# EAGLE design EMUZ80R3 (EAGLE 4.16)
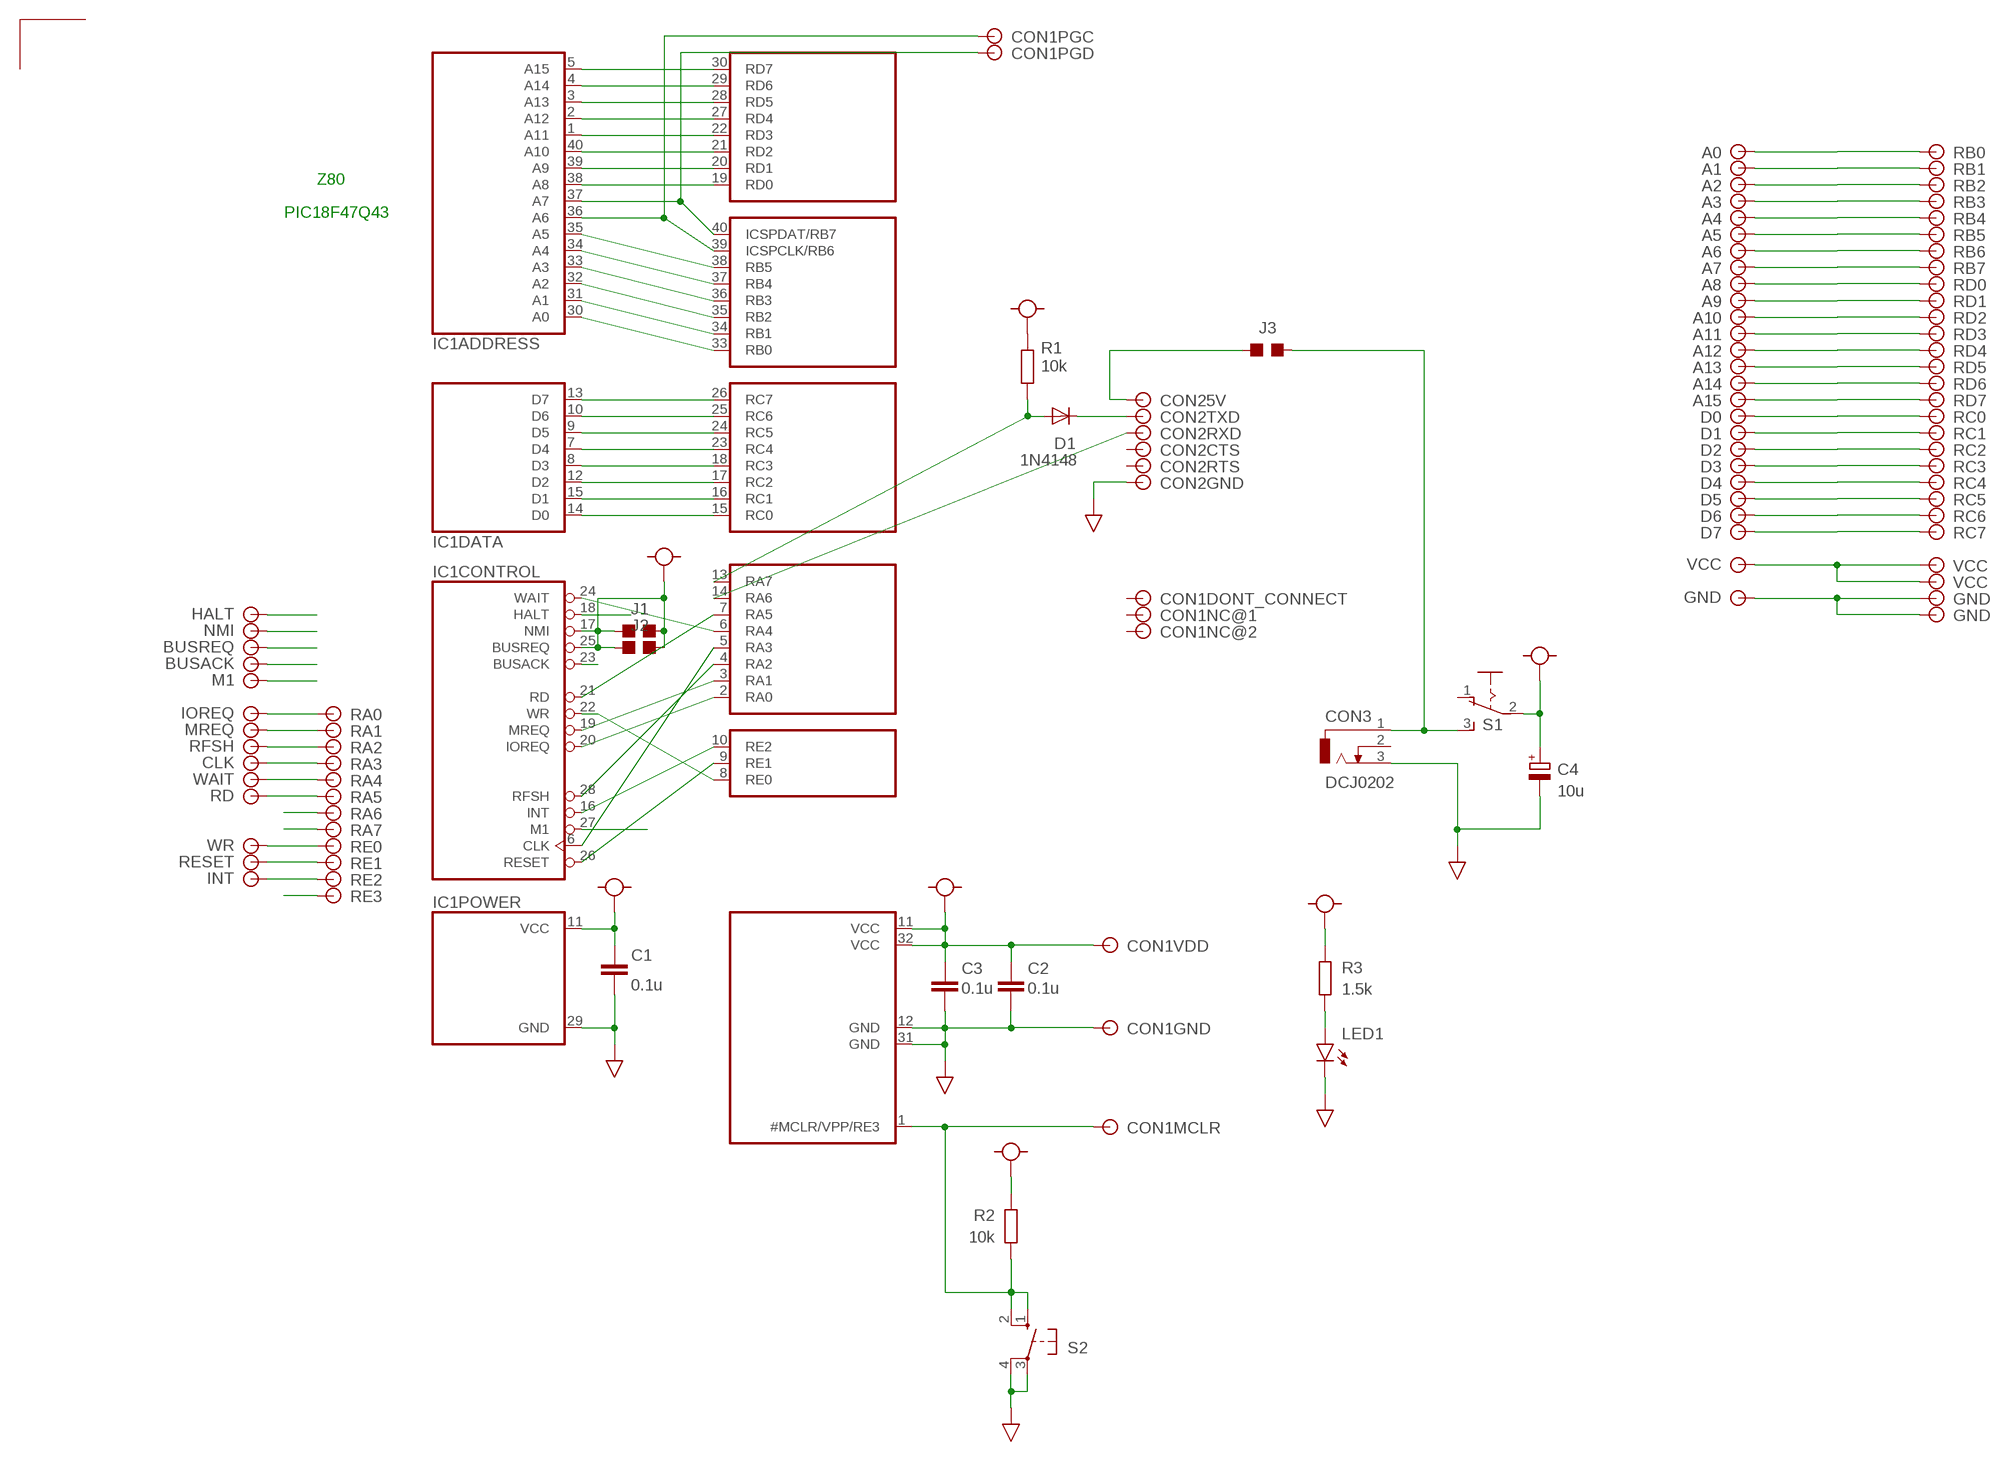
[diagram p0: schematic, sheet 1]

## Parts
C1  0.1u  C-CERAMIC  [C025-025X050]
C2  0.1u  C-CERAMIC  [C025-025X050]
C3  0.1u  C-CERAMIC  [C025-025X050]
C4  10u  C-TANTALUM  [C4518]
CON1  SNAP  [SNAP]
CON2  USB-SERIAL  [USB-SERIAL]
CON3  DCJ0202  [DCJ0202]
D1  1N4148  1S1588  [DO41-10]
IC1  Z80CPU  Z80-CPU  [DIL40]
IC2  PIC18F47Q43  [DIL40]
J1  SOLPAD  [SOLPAD]
J2  SOLPAD  [SOLPAD]
J3  SOLPAD  [SOLPAD]
LED1  LED3MM  [LED3MM]
R1  10k  R1/8W  [0207/10]
R2  10k  R1/8W  [0207/10]
R3  1.5k  R1/8W  [0207/10]
S1  255SB  [255SB]
S2  SW-TACT  [B3F-10XX]
U$1  A0  LAND-NN-N  [LAND-NN-N]
U$2  RB0  LAND-NN-N  [LAND-NN-N]
U$3  A1  LAND-NN-N  [LAND-NN-N]
U$4  RB1  LAND-NN-N  [LAND-NN-N]
U$5  A2  LAND-NN-N  [LAND-NN-N]
U$6  RB2  LAND-NN-N  [LAND-NN-N]
U$7  A3  LAND-NN-N  [LAND-NN-N]
U$8  RB3  LAND-NN-N  [LAND-NN-N]
U$9  A4  LAND-NN-N  [LAND-NN-N]
U$10  RB4  LAND-NN-N  [LAND-NN-N]
U$11  A5  LAND-NN-N  [LAND-NN-N]
U$12  RB5  LAND-NN-N  [LAND-NN-N]
U$13  A6  LAND-NN-N  [LAND-NN-N]
U$14  RB6  LAND-NN-N  [LAND-NN-N]
U$15  A7  LAND-NN-N  [LAND-NN-N]
U$16  RB7  LAND-NN-N  [LAND-NN-N]
U$17  A8  LAND-NN-N  [LAND-NN-N]
U$18  RD0  LAND-NN-N  [LAND-NN-N]
U$19  A9  LAND-NN-N  [LAND-NN-N]
U$20  RD1  LAND-NN-N  [LAND-NN-N]
U$21  A10  LAND-NN-N  [LAND-NN-N]
U$22  RD2  LAND-NN-N  [LAND-NN-N]
U$23  A11  LAND-NN-N  [LAND-NN-N]
U$24  RD3  LAND-NN-N  [LAND-NN-N]
U$25  A12  LAND-NN-N  [LAND-NN-N]
U$26  RD4  LAND-NN-N  [LAND-NN-N]
U$27  A13  LAND-NN-N  [LAND-NN-N]
U$28  RD5  LAND-NN-N  [LAND-NN-N]
U$29  A14  LAND-NN-N  [LAND-NN-N]
U$30  RD6  LAND-NN-N  [LAND-NN-N]
U$31  A15  LAND-NN-N  [LAND-NN-N]
U$32  RD7  LAND-NN-N  [LAND-NN-N]
U$33  D0  LAND-NN-N  [LAND-NN-N]
U$34  RC0  LAND-NN-N  [LAND-NN-N]
U$35  D1  LAND-NN-N  [LAND-NN-N]
U$36  RC1  LAND-NN-N  [LAND-NN-N]
U$37  D2  LAND-NN-N  [LAND-NN-N]
U$38  RC2  LAND-NN-N  [LAND-NN-N]
U$39  D3  LAND-NN-N  [LAND-NN-N]
U$40  RC3  LAND-NN-N  [LAND-NN-N]
U$41  D4  LAND-NN-N  [LAND-NN-N]
U$42  RC4  LAND-NN-N  [LAND-NN-N]
U$43  D5  LAND-NN-N  [LAND-NN-N]
U$44  RC5  LAND-NN-N  [LAND-NN-N]
U$45  D6  LAND-NN-N  [LAND-NN-N]
U$46  RC6  LAND-NN-N  [LAND-NN-N]
U$47  D7  LAND-NN-N  [LAND-NN-N]
U$48  RC7  LAND-NN-N  [LAND-NN-N]
U$49  VCC  LAND-NN-N  [LAND-NN-N]
U$50  VCC  LAND-NN-N  [LAND-NN-N]
U$51  RA7  LAND-NN-N  [LAND-NN-N]
U$52  VCC  LAND-NN-N  [LAND-NN-N]
U$53  WAIT  LAND-NN-N  [LAND-NN-N]
U$54  RA3  LAND-NN-N  [LAND-NN-N]
U$55  RA6  LAND-NN-N  [LAND-NN-N]
U$56  GND  LAND-NN-N  [LAND-NN-N]
U$57  GND  LAND-NN-N  [LAND-NN-N]
U$58  HALT  LAND-NN-N  [LAND-NN-N]
U$59  RE3  LAND-NN-N  [LAND-NN-N]
U$60  GND  LAND-NN-N  [LAND-NN-N]
U$61  NMI  LAND-NN-N  [LAND-NN-N]
U$62  BUSREQ  LAND-NN-N  [LAND-NN-N]
U$63  BUSACK  LAND-NN-N  [LAND-NN-N]
U$64  RD  LAND-NN-N  [LAND-NN-N]
U$65  RE1  LAND-NN-N  [LAND-NN-N]
U$66  WR  LAND-NN-N  [LAND-NN-N]
U$67  MREQ  LAND-NN-N  [LAND-NN-N]
U$68  RA1  LAND-NN-N  [LAND-NN-N]
U$69  IOREQ  LAND-NN-N  [LAND-NN-N]
U$70  RA0  LAND-NN-N  [LAND-NN-N]
U$71  RFSH  LAND-NN-N  [LAND-NN-N]
U$72  RE0  LAND-NN-N  [LAND-NN-N]
U$73  INT  LAND-NN-N  [LAND-NN-N]
U$74  RA2  LAND-NN-N  [LAND-NN-N]
U$75  M1  LAND-NN-N  [LAND-NN-N]
U$76  RA4  LAND-NN-N  [LAND-NN-N]
U$77  CLK  LAND-NN-N  [LAND-NN-N]
U$78  RA5  LAND-NN-N  [LAND-NN-N]
U$79  RESET  LAND-NN-N  [LAND-NN-N]
U$80  RE2  LAND-NN-N  [LAND-NN-N]

## Nets
A0: IC1.30(ADDRESS:A0) IC2.33(RB0) U$1.P U$2.P
A1: IC1.31(ADDRESS:A1) IC2.34(RB1) U$3.P U$4.P
A2: IC1.32(ADDRESS:A2) IC2.35(RB2) U$5.P U$6.P
A3: IC1.33(ADDRESS:A3) IC2.36(RB3) U$7.P U$8.P
A4: IC1.34(ADDRESS:A4) IC2.37(RB4) U$9.P U$10.P
A5: IC1.35(ADDRESS:A5) IC2.38(RB5) U$11.P U$12.P
A6: CON1.5 IC1.36(ADDRESS:A6) IC2.39(ICSPCLK/RB6) U$13.P U$14.P
A7: CON1.4 IC1.37(ADDRESS:A7) IC2.40(ICSPDAT/RB7) U$15.P U$16.P
A8: IC1.38(ADDRESS:A8) IC2.19(RD0) U$17.P U$18.P
A9: IC1.39(ADDRESS:A9) IC2.20(RD1) U$19.P U$20.P
A10: IC1.40(ADDRESS:A10) IC2.21(RD2) U$21.P U$22.P
A11: IC1.1(ADDRESS:A11) IC2.22(RD3) U$23.P U$24.P
A12: IC1.2(ADDRESS:A12) IC2.27(RD4) U$25.P U$26.P
A13: IC1.3(ADDRESS:A13) IC2.28(RD5) U$27.P U$28.P
A14: IC1.4(ADDRESS:A14) IC2.29(RD6) U$29.P U$30.P
A15: IC1.5(ADDRESS:A15) IC2.30(RD7) U$31.P U$32.P
BUSACK: IC1.23(CONTROL:BUSACK) U$63.P
CLK: IC1.6(CONTROL:CLK) IC2.5(RA3) U$54.P U$77.P
D0: IC1.14(DATA:D0) IC2.15(RC0) U$33.P U$34.P
D1: IC1.15(DATA:D1) IC2.16(RC1) U$35.P U$36.P
D2: IC1.12(DATA:D2) IC2.17(RC2) U$37.P U$38.P
D3: IC1.8(DATA:D3) IC2.18(RC3) U$39.P U$40.P
D4: IC1.7(DATA:D4) IC2.23(RC4) U$41.P U$42.P
D5: IC1.9(DATA:D5) IC2.24(RC5) U$43.P U$44.P
D6: IC1.10(DATA:D6) IC2.25(RC6) U$45.P U$46.P
D7: IC1.13(DATA:D7) IC2.26(RC7) U$47.P U$48.P
GND: C1.2 C2.2 C3.2 C4.- CON1.3 CON2.1 CON3.3 IC1.29(POWER:GND) IC2.12(GND) IC2.31(GND) LED1.K(C) S2.3(P) S2.4(P1) U$56.P U$57.P U$60.P
HALT: IC1.18(CONTROL:HALT) U$58.P
INT: IC1.16(CONTROL:INT) IC2.10(RE2) U$73.P U$80.P
IOREQ: IC1.20(CONTROL:IOREQ) IC2.2(RA0) U$69.P U$70.P
M1: IC1.27(CONTROL:M1) U$75.P
MCLR: CON1.1 IC2.1(#MCLR/VPP/RE3) R2.1 S2.1(S) S2.2(S1) U$59.P
MREQ: IC1.19(CONTROL:MREQ) IC2.3(RA1) U$67.P U$68.P
N$2: CON2.3 J3.1
N$30: CON2.4 D1.C
N$37: LED1.A R3.2
N$38: CON3.1 J3.2 S1.3(S)
RD: IC1.21(CONTROL:RD) IC2.7(RA5) U$64.P U$78.P
RESET: IC1.26(CONTROL:RESET) IC2.9(RE1) U$65.P U$79.P
RFSH: IC1.28(CONTROL:RFSH) IC2.4(RA2) U$71.P U$74.P
RXD: D1.A IC2.13(RA7) R1.1 U$51.P
TXD: CON2.5 IC2.14(RA6) U$55.P
VCC: C1.1 C2.1 C3.1 C4.+ CON1.2 IC1.11(POWER:VCC) IC1.17(CONTROL:NMI) IC1.25(CONTROL:BUSREQ) IC2.11(VCC) IC2.32(VCC) J1.1 J1.2 J2.1 J2.2 R1.2 R2.2 R3.1 S1.2(P) U$49.P U$50.P U$52.P U$61.P U$62.P
WAIT: IC1.24(CONTROL:WAIT) IC2.6(RA4) U$53.P U$76.P
WR: IC1.22(CONTROL:WR) IC2.8(RE0) U$66.P U$72.P
Unconnected: CON1.6 CON1.7 CON1.8 CON2.2 CON2.6 CON3.2 S1.1(O)

## Notes on the sheet
- Z80
- PIC18F47Q43

## Library data of the parts
C1-C3 = olimex-devices:C-CERAMIC: Ceramic Conenser
C4 = olimex-devices:C-TANTALUM: Tantalum Condenser
CON1 = olimex-devices:SNAP
CON2 = olimex-devices:USB-SERIAL
CON3 = olimex-devices:DCJ0202: DC POWER JACK Source: DCJ0202.pdf
D1 = olimex-devices:1S1588: Small Signal Diode
IC1 = olimex-devices:Z80-CPU
IC2 = olimex-devices:PIC18F47Q43
J1-J3 = olimex-devices:SOLPAD
LED1 = olimex-devices:LED3MM: LED
R1-R3 = olimex-devices:R1/8W: Carbon Resistor
S1 = olimex-devices:255SB: SLIDING SWITCH distributor Buerklin, 11G810
S2 = olimex-devices:SW-TACT: Tact Switch (Small)
U$1-U$80 = olimex-devices:LAND-NN-N

## Board
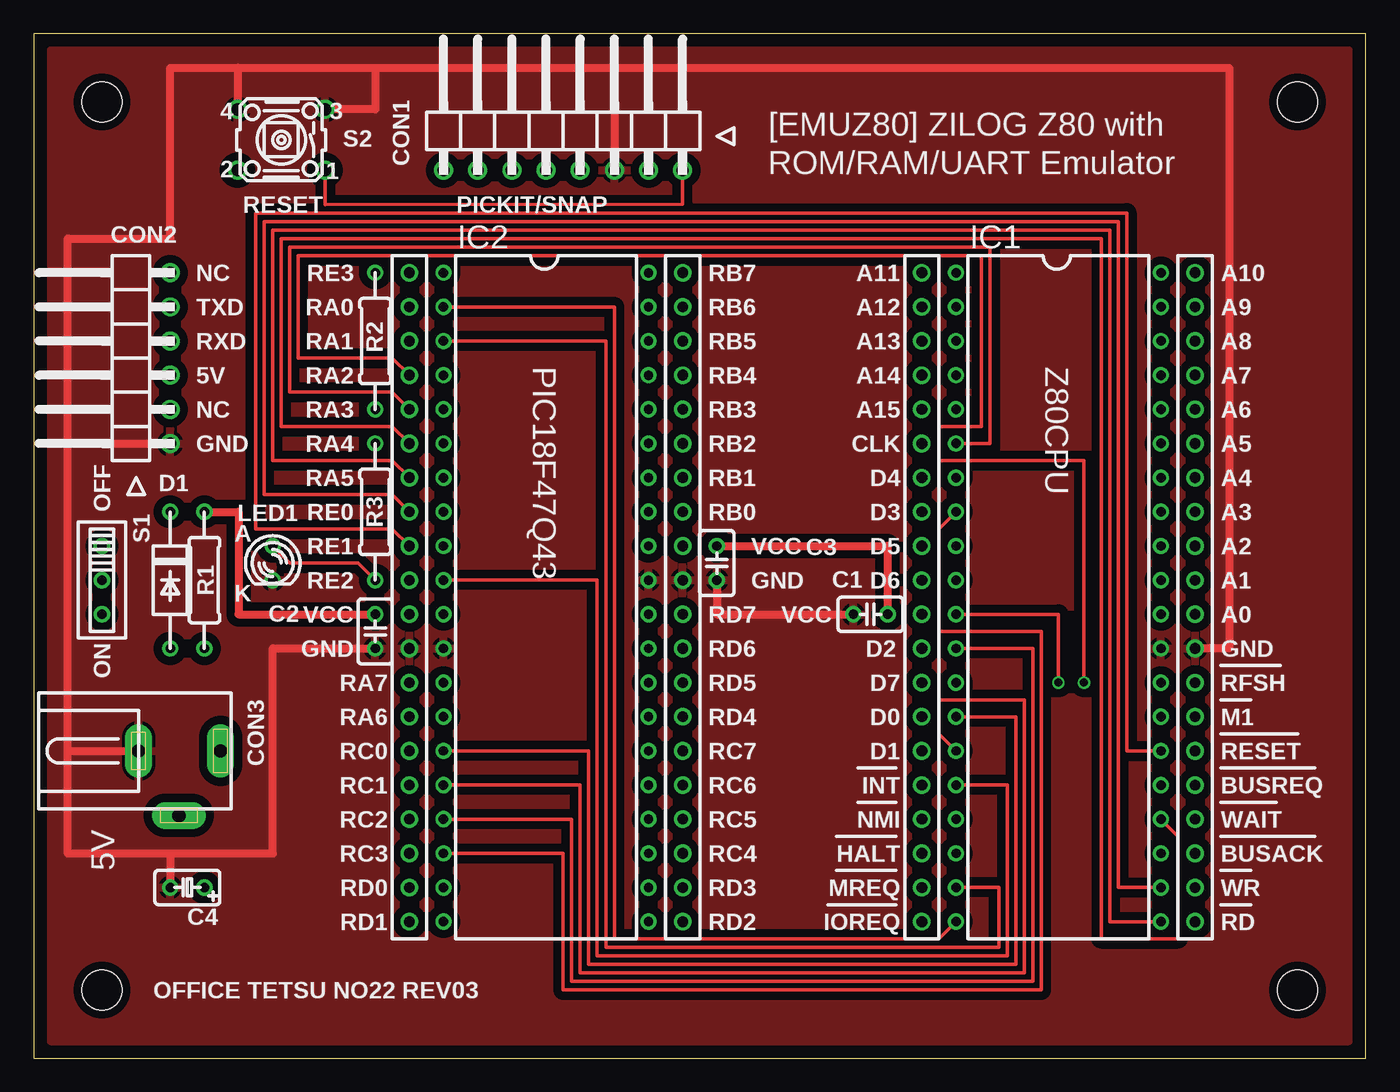
[diagram p1: board, top side]
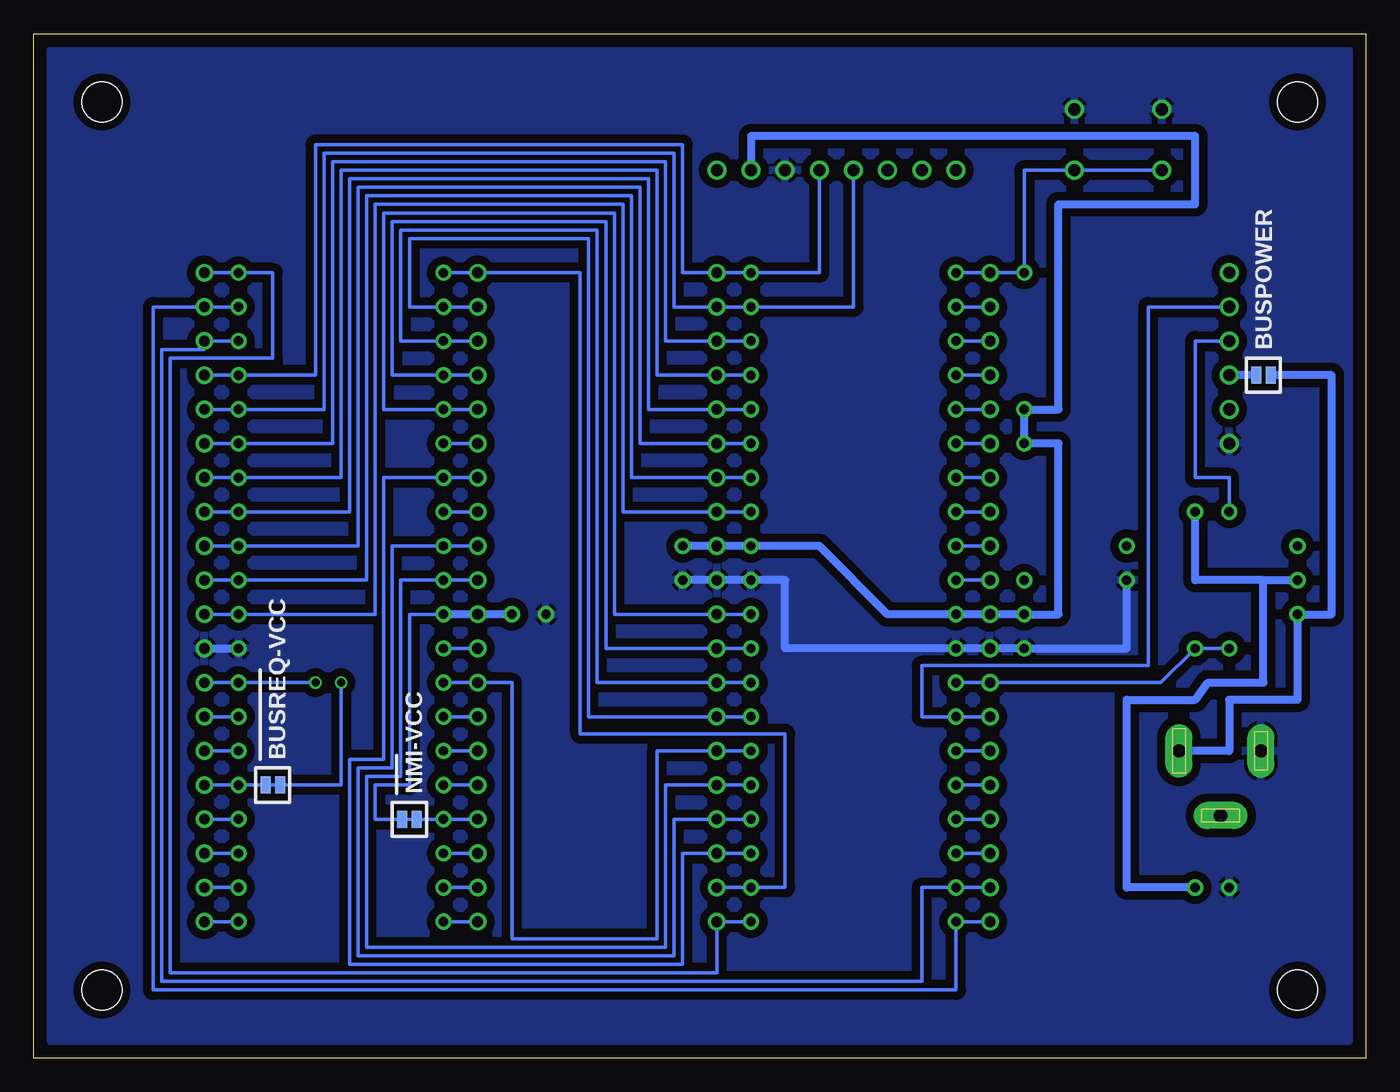
[diagram p2: board, bottom side, seen from below]

Size 99.06 x 76.2 mm. Coordinates in mm from the lower left corner, seen from the top.
Outline: 0,0 99.06,0 99.06,76.2 0,76.2 0,0
Copper layers (1*16): Top 0.035mm / dielectric 1.5mm / Bottom 0.035mm
Design rules "OfficeTETSUstandard": minimum track width 6mil, minimum drill 12mil, track to track 6mil, track to pad 6mil, pad to pad 6mil, via to via 6mil, smd to smd 0mil, copper to edge 10mil, drill to drill 10mil, minimum pad ring 10mil, minimum via ring 6mil, stop-mask expansion 2mil, vias tented up to drill 25mil, thermal gap 10mil
Holes 3 mm at 93.98,5.08 93.98,71.12 5.08,5.08 5.08,71.12

### Footprints (pad centres in the part's own frame; a part is rotated, then mirrored left to right if it is on the bottom)
C025-025X050 = drill 0.7 round: 1 -1.27,0; 2 1.27,0
C4518 = drill 0.7 round: + -1.27,0; - 1.27,0
SNAP = drill 0.9 round: 1 8.89,-2.54; 2 6.35,-2.54; 3 3.81,-2.54; 4 1.27,-2.54; 5 -1.27,-2.54; 6 -3.81,-2.54; 7 -6.35,-2.54; 8 -8.89,-2.54
USB-SERIAL = drill 0.9 round: 1 -6.35,-1.27; 2 -3.81,-1.27; 3 -1.27,-1.27; 4 1.27,-1.27; 5 3.81,-1.27; 6 6.35,-1.27
DCJ0202 = drill 1 pad 2 long: 1 0,3.1; 2 4.8,0; 3 0,-3
DO41-10 = drill 0.7 round: A 5.08,0; C -5.08,0
DIL40 = drill 0.7 round: 1 -24.13,-7.62; 2 -21.59,-7.62; 3 -19.05,-7.62; 4 -16.51,-7.62; 5 -13.97,-7.62; 6 -11.43,-7.62; 7 -8.89,-7.62; 8 -6.35,-7.62; 9 -3.81,-7.62; 10 -1.27,-7.62; 11 1.27,-7.62; 12 3.81,-7.62; 13 6.35,-7.62; 14 8.89,-7.62; 15 11.43,-7.62; 16 13.97,-7.62; 17 16.51,-7.62; 18 19.05,-7.62; 19 21.59,-7.62; 20 24.13,-7.62; 21 24.13,7.62; 22 21.59,7.62; 23 19.05,7.62; 24 16.51,7.62; 25 13.97,7.62; 26 11.43,7.62; 27 8.89,7.62; 28 6.35,7.62; 29 3.81,7.62; 30 1.27,7.62; 31 -1.27,7.62; 32 -3.81,7.62; 33 -6.35,7.62; 34 -8.89,7.62; 35 -11.43,7.62; 36 -13.97,7.62; 37 -16.51,7.62; 38 -19.05,7.62; 39 -21.59,7.62; 40 -24.13,7.62
SOLPAD = smd 0.736 x 1.27: 1 -0.54,0; 2 0.54,0
LED3MM = drill 0.7 round: A -1.27,0; K 1.27,0
0207/10 = drill 0.7 round: 1 -5.08,0; 2 5.08,0
255SB = drill 0.7 round: 1 -2.54,0; 2 0,0; 3 2.54,0
B3F-10XX = drill 0.9 round: 1 -3.251,2.261; 2 3.251,2.261; 3 -3.251,-2.261; 4 3.251,-2.261
LAND-NN-N = drill 0.8 round: P 0,0

### Placement (x,y rotation side)
C1  62.23,33.02 180 top
C2  25.4,31.75 270 top
C3  50.8,36.83 270 top
C4  11.43,12.7 180 top
CON1  39.37,68.58 0 top
CON2  8.89,52.07 90 top
CON3  10.79,22.86 270 top
D1  10.16,35.56 270 top
IC1  76.2,34.29 270 top
IC2  38.1,34.29 270 top
J1  71.12,17.78 180 bottom
J2  81.28,20.32 0 bottom
J3  7.62,50.8 0 bottom
LED1  17.78,36.83 270 top
R1  12.7,35.56 90 top
R2  25.4,53.34 270 top
R3  25.4,40.64 270 top
S1  5.08,35.56 270 top
S2  18.41,68.3 180 top
U$1  86.36,33.02 0 top
U$2  48.26,40.64 0 top
U$3  86.36,35.56 0 top
U$4  48.26,43.18 0 top
U$5  86.36,38.1 0 top
U$6  48.26,45.72 0 top
U$7  86.36,40.64 0 top
U$8  48.26,48.26 0 top
U$9  86.36,43.18 0 top
U$10  48.26,50.8 0 top
U$11  86.36,45.72 0 top
U$12  48.26,53.34 0 top
U$13  86.36,48.26 0 top
U$14  48.26,55.88 0 top
U$15  86.36,50.8 0 top
U$16  48.26,58.42 0 top
U$17  86.36,53.34 0 top
U$18  27.94,12.7 180 top
U$19  86.36,55.88 0 top
U$20  27.94,10.16 180 top
U$21  86.36,58.42 0 top
U$22  48.26,10.16 0 top
U$23  66.04,58.42 180 top
U$24  48.26,12.7 0 top
U$25  66.04,55.88 180 top
U$26  48.26,25.4 0 top
U$27  66.04,53.34 180 top
U$28  48.26,27.94 0 top
U$29  66.04,50.8 180 top
U$30  48.26,30.48 0 top
U$31  66.04,48.26 180 top
U$32  48.26,33.02 0 top
U$33  66.04,25.4 180 top
U$34  27.94,22.86 180 top
U$35  66.04,22.86 180 top
U$36  27.94,20.32 180 top
U$37  66.04,30.48 180 top
U$38  27.94,17.78 180 top
U$39  66.04,40.64 180 top
U$40  27.94,15.24 180 top
U$41  66.04,43.18 180 top
U$42  48.26,15.24 0 top
U$43  66.04,38.1 180 top
U$44  48.26,17.78 0 top
U$45  66.04,35.56 180 top
U$46  48.26,20.32 0 top
U$47  66.04,27.94 180 top
U$48  48.26,22.86 0 top
U$49  66.04,33.02 180 top
U$50  27.94,33.02 180 top
U$51  27.94,27.94 180 top
U$52  48.26,38.1 0 top
U$53  86.36,17.78 0 top
U$54  27.94,48.26 180 top
U$55  27.94,25.4 180 top
U$56  86.36,30.48 0 top
U$57  27.94,30.48 180 top
U$58  66.04,15.24 180 top
U$59  27.94,58.42 180 top
U$60  48.26,35.56 0 top
U$61  66.04,17.78 180 top
U$62  86.36,20.32 0 top
U$63  86.36,15.24 0 top
U$64  86.36,10.16 0 top
U$65  27.94,38.1 180 top
U$66  86.36,12.7 0 top
U$67  66.04,12.7 180 top
U$68  27.94,53.34 180 top
U$69  66.04,10.16 180 top
U$70  27.94,55.88 180 top
U$71  86.36,27.94 0 top
U$72  27.94,40.64 180 top
U$73  66.04,20.32 180 top
U$74  27.94,50.8 180 top
U$75  86.36,25.4 0 top
U$76  27.94,45.72 180 top
U$77  66.04,45.72 180 top
U$78  27.94,43.18 180 top
U$79  86.36,22.86 0 top
U$80  27.94,35.56 180 top

### Tracks (layer width: path | path; a pad name or v marks a point on that pad's centre or on a via)
A0
  Bottom 0.254: U$1.P IC1.30 73.66,33.02 73.66,63.5 55.24,63.5 55.24,40.64 U$2.P IC2.33
A1
  Bottom 0.254: U$3.P IC1.31 74.3,35.56 74.3,64.14 54.61,64.14 54.61,43.18 U$4.P IC2.34
A2
  Bottom 0.254: U$5.P IC1.32 74.93,38.1 74.93,64.77 53.98,64.77 53.98,45.72 U$6.P IC2.35
A3
  Bottom 0.254: U$7.P IC1.33 75.56,40.64 75.56,65.41 53.34,65.41 53.34,48.26 U$8.P IC2.36
A4
  Bottom 0.254: U$9.P IC1.34 76.2,43.18 76.2,66.04 52.7,66.04 52.7,50.8 U$10.P IC2.37
A5
  Bottom 0.254: U$11.P IC1.35 76.83,45.72 76.83,66.67 52.07,66.67 52.07,53.34 U$12.P IC2.38
A6
  Bottom 0.254: U$13.P IC1.36 77.47,48.26 77.47,67.31 51.44,67.31 51.44,55.88 U$14.P IC2.39 38.1,55.88 CON1.5
A7
  Bottom 0.254: U$15.P IC1.37 78.11,50.8 78.11,67.94 50.8,67.94 50.8,58.42 U$16.P IC2.40 40.64,58.42 CON1.4
A8
  Bottom 0.254: IC1.38 U$17.P 86.36,52.7 89.53,52.7 89.53,5.71 33.02,5.71 33.02,12.7 IC2.19 U$18.P
A9
  Bottom 0.254: IC1.39 U$19.P 90.17,55.88 90.17,5.08 30.48,5.08 IC2.20 U$20.P
A10
  Bottom 0.254: U$21.P IC1.40 81.28,58.42 81.28,52.07 88.9,52.07 88.9,6.35 48.26,6.35 U$22.P IC2.21
A11
  Bottom 0.254: IC1.1 U$23.P 58.42,58.42 58.42,24.13 43.18,24.13 43.18,12.7 IC2.22 U$24.P
A12
  Bottom 0.254: U$25.P IC1.2 71.12,55.88 71.12,60.96 57.78,60.96 57.78,25.4 U$26.P IC2.27
A13
  Bottom 0.254: U$27.P IC1.3 71.75,53.34 71.75,61.59 57.15,61.59 57.15,27.94 U$28.P IC2.28
A14
  Bottom 0.254: U$29.P IC1.4 72.39,50.8 72.39,62.23 56.52,62.23 56.52,30.48 U$30.P IC2.29
A15
  Bottom 0.254: U$31.P IC1.5 73.03,48.26 73.03,62.87 55.88,62.87 55.88,33.02 U$32.P IC2.30
BUSACK
  Bottom 0.254: IC1.23 U$63.P
CLK
  Top 0.254: U$54.P 26.67,49.53 19.05,49.53 19.05,60.33 71.12,60.33 71.12,45.72 IC1.6
  Bottom 0.254: U$54.P IC2.5 | IC1.6 U$77.P
D0
  Top 0.254: IC2.15 41.27,22.86 41.27,6.99 73.03,6.99 73.03,25.4 IC1.14
  Bottom 0.254: IC1.14 U$33.P | IC2.15 U$34.P
D1
  Top 0.254: IC2.16 40.64,20.32 40.64,6.35 73.66,6.35 73.66,26.67 67.31,26.67 67.31,24.13 IC1.15
  Bottom 0.254: IC1.15 U$35.P | IC2.16 U$36.P
D2
  Top 0.254: IC2.17 40.01,17.78 40.01,5.71 74.3,5.71 74.3,30.48 IC1.12
  Bottom 0.254: IC1.12 U$37.P | IC2.17 U$38.P
D3
  Top 0.254: IC2.18 39.37,15.24 39.37,5.08 74.93,5.08 74.93,31.75 67.31,31.75 67.31,39.37 IC1.8
  Bottom 0.254: U$40.P IC2.18 | IC1.8 U$39.P
D4
  Bottom 0.254: U$41.P IC1.7 73.03,43.18 73.03,22.23 75.56,22.23 75.56,6.99 50.8,6.99 50.8,15.24 U$42.P IC2.23
D5
  Bottom 0.254: U$43.P IC1.9 72.39,38.1 72.39,21.59 74.93,21.59 74.93,7.62 51.44,7.62 51.44,17.78 U$44.P IC2.24
D6
  Bottom 0.254: U$45.P IC1.10 71.75,35.56 71.75,20.95 74.3,20.95 74.3,8.26 52.07,8.26 52.07,20.32 U$46.P IC2.25
D7
  Bottom 0.254: IC1.13 U$47.P 63.5,27.94 63.5,8.89 52.7,8.89 52.7,22.86 U$48.P IC2.26
GND
  Top 0.61: C3.2 50.8,33.02 C1.2 | U$56.P 88.9,30.48 88.9,73.66 43.18,73.66 | 43.18,73.66 CON1.3 | S2.4 15.16,73.66 15.24,73.66 | S2.3 25.4,70.56 25.4,73.66 21.67,73.66 | 15.24,73.66 21.67,73.66 | 21.67,73.66 43.18,73.66 | 2.54,45.72 CON2.1 | 2.54,22.86 2.54,45.72 | 15.24,73.66 10.16,73.66 10.16,60.96 2.54,60.96 2.54,45.72 | C2.2 17.78,30.48 17.78,15.24 10.16,15.24 | 10.16,15.24 C4.- | 2.54,22.86 CON3.3 | 10.16,15.24 2.54,15.24 2.54,22.86
  Bottom 0.61: C3.2 U$60.P IC2.31 43.18,35.56 43.18,30.48 IC2.12 U$57.P C2.2 17.78,30.48 LED1.K | U$56.P IC1.29
  pour Bottom (isolate 0.61): 1.27,74.93 1.27,1.27 97.79,1.27 97.79,74.93
  pour Top (isolate 0.61): 1.27,74.93 1.27,1.27 97.79,1.27 97.79,74.93
HALT
  Bottom 0.254: U$58.P IC1.18
INT
  Top 0.254: IC2.10 41.91,35.56 41.91,7.62 72.39,7.62 72.39,20.32 IC1.16
  Bottom 0.254: IC2.10 U$80.P | IC1.16 U$73.P
IOREQ
  Top 0.254: IC2.2 43.18,55.88 43.18,8.89 67.31,8.89 IC1.20
  Bottom 0.254: IC1.20 U$69.P | IC2.2 U$70.P
M1
  Bottom 0.254: IC1.27 U$75.P
MCLR
  Top 0.254: CON1.1 48.26,63.5 21.69,63.48 21.68,66.04 S2.1 | S2.1 | S2.1
  Bottom 0.254: IC2.1 U$59.P R2.1 25.4,66.04 S2.1 | S2.2 S2.1 | S2.1
MREQ
  Top 0.254: IC2.3 42.55,53.34 42.55,8.26 71.75,8.26 71.75,12.7 IC1.19
  Bottom 0.254: IC1.19 U$67.P | IC2.3 U$68.P
N$2
  Bottom 0.61: J3.1 CON2.3
N$30
  Bottom 0.254: CON2.4 12.7,53.34 12.7,43.18 10.16,43.18 D1.C
N$37
  Top 0.254: LED1.A 19.05,36.83 24.13,36.83 R3.2
N$38
  Bottom 0.61: J3.2 2.54,50.8 2.54,33.02 S1.3 5.08,26.67 10.16,26.67 10.16,22.86 CON3.1
RD
  Top 0.254: U$78.P 26.67,44.45 17.78,44.45 17.78,61.59 80.01,61.59 80.01,10.16 IC1.21
  Bottom 0.254: IC1.21 U$64.P | U$78.P IC2.7
RESET
  Top 0.254: U$65.P 26.67,39.37 16.51,39.37 16.51,62.87 81.28,62.87 81.28,22.86 IC1.26
  Bottom 0.254: IC1.26 U$79.P | U$65.P IC2.9
RFSH  (via drill 0.6)
  Top 0.254: U$74.P 26.67,52.07 19.68,52.07 19.68,59.69 70.48,59.69 70.48,46.99 67.31,46.99 67.31,44.45 78.11,44.45 v78.11,27.94
  Bottom 0.254: U$74.P IC2.4 | U$71.P IC1.28 v78.11,27.94
RXD
  Bottom 0.254: IC2.13 U$51.P 15.24,27.94 R1.1 D1.A
TXD
  Bottom 0.254: U$55.P IC2.14 33.02,25.4 33.02,29.21 16.19,29.21 16.19,55.88 CON2.5
VCC  (via drill 0.6)
  Top 0.254: IC1.11 76.2,33.02 v76.2,27.94
  Top 0.61: C3.1 63.5,38.1 C1.1 | R1.2 15.24,40.64 15.24,33.02 C2.1
  Bottom 0.254: v76.2,27.94 76.2,20.32 J2.2 81.92,20.32 | 71.75,17.78 73.66,17.78 73.66,20.32 71.12,20.32 71.12,33.02 IC1.11 | 81.92,20.32 IC1.25 U$62.P | 71.75,17.78 J1.2 | 71.75,17.78 J1.1 IC1.17 U$61.P | 81.92,20.32 J2.1
  Bottom 0.61: C3.1 U$52.P IC2.32 40.64,38.1 35.56,33.02 IC2.11 U$50.P C2.1 22.86,33.02 22.86,45.72 R3.1 R2.2 22.86,48.26 22.86,63.5 12.7,63.5 12.7,68.58 45.72,68.58 CON1.2 | IC1.11 U$49.P C1.1 | 7.62,35.56 S1.2 | 7.62,35.56 12.7,35.56 R1.2 | C4.+ 17.78,12.7 17.78,26.67 12.7,26.67 11.75,27.94 7.62,27.94 7.62,35.56
WAIT
  Top 0.254: U$76.P 26.67,46.99 18.41,46.99 18.41,60.96 79.38,60.96 79.38,8.89 85.09,8.89 85.09,16.51 IC1.24
  Bottom 0.254: U$76.P IC2.6 | IC1.24 U$53.P
WR
  Top 0.254: U$72.P 26.67,41.91 17.14,41.91 17.14,62.23 80.64,62.23 80.64,12.7 IC1.22
  Bottom 0.254: IC1.22 U$66.P | U$72.P IC2.8

### Text on the board
tPlace: [EMUZ80] ZILOG Z80 with | ROM/RAM/UART Emulator | RESET | PICKIT/SNAP | NC | TXD | RXD | 5V | NC | GND | OFF | A | K | ON | 5V | OFFICE TETSU NO22 REV03
bPlace: BUSPOWER | BUSREQ-VCC | NMI-VCC